# Altium schematic sheet Sheet1.SchDoc
size A4; SheetNumber: 2; SheetTotal: 4
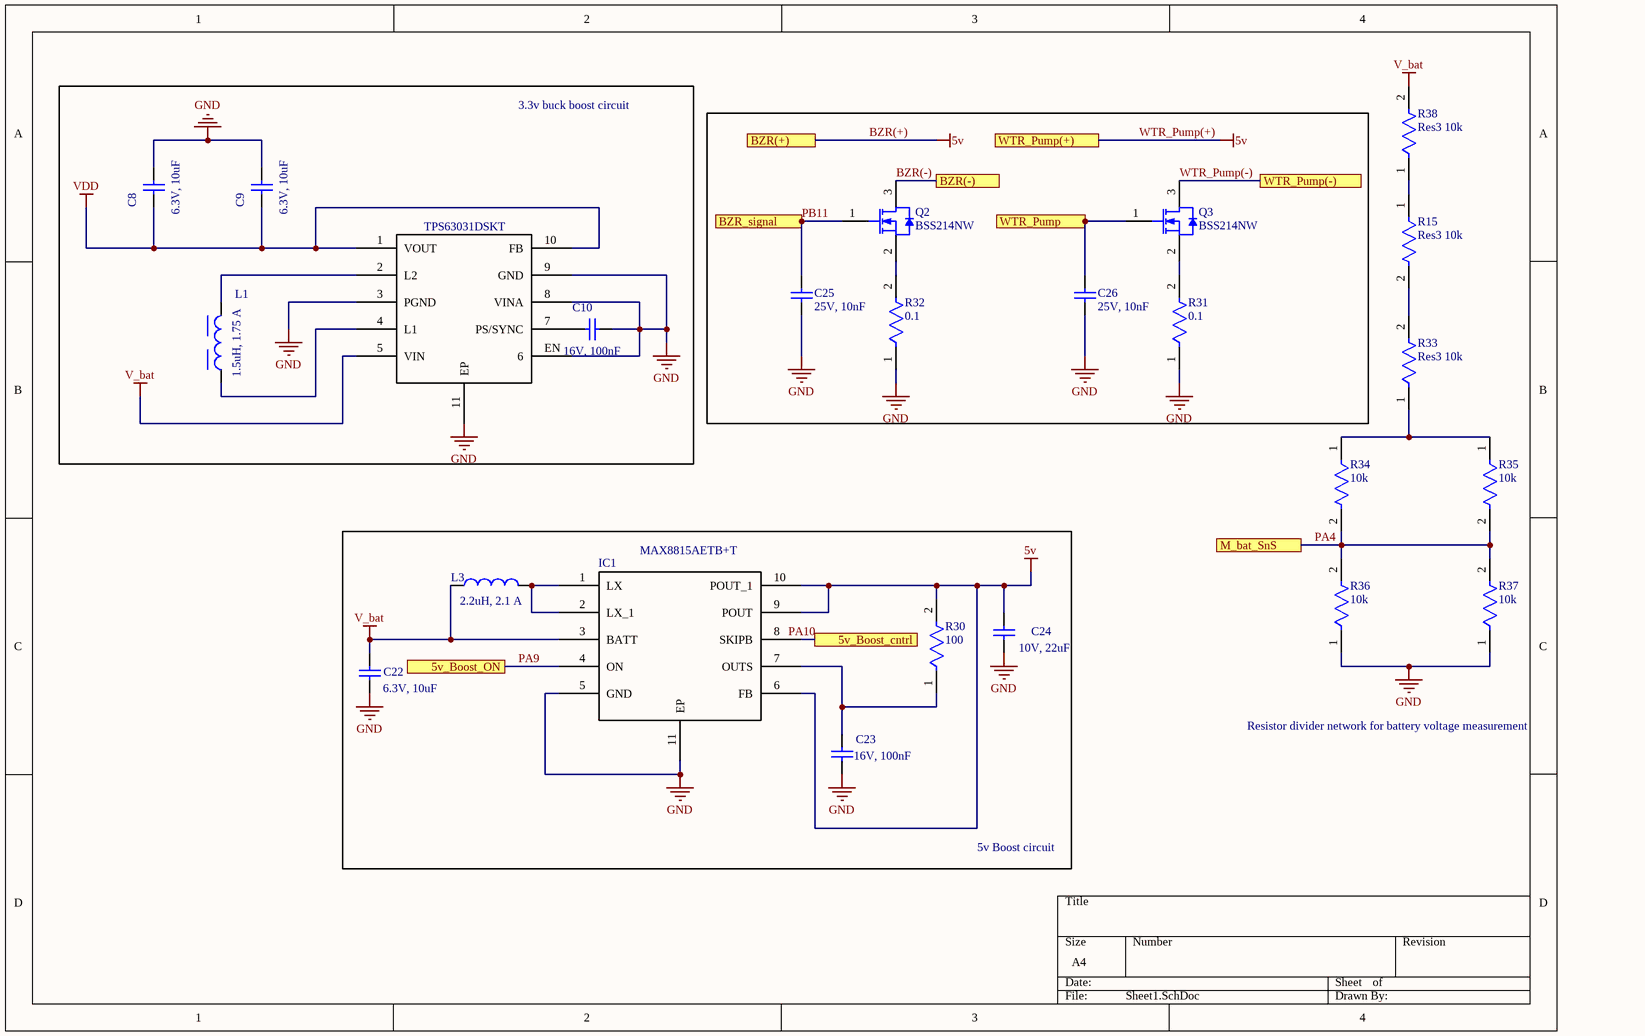
[diagram p0: Sheet1.SchDoc]

## Parts
C8  6.3V, 10uF  [WCAP-CSGP_0603_L1.6W0.8H0.8_Reflow]
C9  6.3V, 10uF  [WCAP-CSGP_0603_L1.6W0.8H0.8_Reflow]
C10  16V, 100nF  [WCAP-CSGP_0603_L1.6W0.8H0.8_Reflow]
C22  6.3V, 10uF  [WCAP-CSGP_0603_L1.6W0.8H0.8_Reflow]
C23  16V, 100nF  [WCAP-CSGP_0603_L1.6W0.8H0.8_Reflow]
C24  10V, 22uF  [WCAP-CSGP_0805_L2W1.25H1.25]
C25  25V, 10nF  [CAPC2013X94X50LL20T25]
C26  25V, 10nF  [CAPC2013X94X50LL20T25]
IC1  MAX8815AETB+T
L1  1.5uH, 1.75 A  [WE-TPC_3816]
L3  2.2uH, 2.1 A  [WE-PMCI_322512]
Q2  BSS214NW  [INF-PG-SOT-323_N]
Q3  BSS214NW  [INF-PG-SOT-323_N]
R15  Res3 10k  [FP-MCT0603-MFG]
R30  100  [FP-RT0603-MFG]
R31  0.1  [FP-RL0603-0_55-MFG]
R32  0.1  [FP-RL0603-0_55-MFG]
R33  Res3 10k  [FP-MCT0603-IPC_B]
R34  10k  [FP-MCT0603-MFG]
R35  10k  [FP-MCT0603-MFG]
R36  10k  [FP-MCT0603-MFG]
R37  10k  [FP-MCT0603-MFG]
R38  Res3 10k  [FP-MCT0603-MFG]
U3  TPS63031DSKT  [R_0603]

## Blocks framed on the sheet
3.3v buck boost circuit: C8-C10 L1 U3
5v Boost circuit: C22-C24 IC1 L3 R30

## Ports
5v_Boost_cntrl (see Sheet3[3C]), 5v_Boost_ON (see Sheet3[3C]), BZR(+) (see Sheet2[3C]), BZR(-) (see Sheet2[3C]), BZR_signal (see Sheet3[3D]), M_bat_SnS (see Sheet3[2D]), WTR_Pump (see Sheet3[3B]), WTR_Pump(+) (see Sheet2[3C]), WTR_Pump(-) (see Sheet2[3C])

## Nets
BZR(+): C24.2 IC1.6(FB) IC1.9(POUT) IC1.10(POUT_1) R30.2 ; port BZR(+), port WTR_Pump(+)  [also labelled 5v, WTR_Pump(+)]
GND: C8.2 C9.2 C10.2 C22.1 C23.1 C24.1 C25.1 C26.1 IC1.5(GND) IC1.11(EP) R31.1 R32.1 R36.1 R37.1 U3.3(PGND) U3.8(VINA) U3.9(GND) U3.11(EP) U3.EN(6)
V_bat: C22.2 IC1.3(BATT) L3.1 R38.2 U3.5(VIN)
VDD: C8.1 C9.1 U3.1(VOUT) U3.10(FB)
5v_Boost_cntrl: IC1.8(SKIPB) ; port 5v_Boost_cntrl
BZR(-): Q2.3(DRAIN) ; port BZR(-)
PA4: R34.2 R35.2 R36.2 R37.2 ; port M_bat_SnS
PA9: IC1.4(ON) ; port 5v_Boost_ON
PB11: C25.2 Q2.1(GATE) ; port BZR_signal
WTR_Pump: C26.2 Q3.1(GATE) ; port WTR_Pump
WTR_Pump(-): Q3.3(DRAIN) ; port WTR_Pump(-)
NetC10_1: C10.1 U3.7(PS/SYNC)
NetC23_2: C23.2 IC1.7(OUTS) R30.1
NetIC1_1: IC1.1(LX) IC1.2(LX_1) L3.2
NetL1_1: L1.1 U3.4(L1)
NetL1_2: L1.2 U3.2(L2)
NetQ2_2: Q2.2(SOURCE) R32.2
NetQ3_2: Q3.2(SOURCE) R31.2
NetR15_1: R15.1 R38.1
NetR15_2: R15.2 R33.2
NetR33_1: R33.1 R34.1 R35.1

## Notes on the sheet
- Resistor divider network for battery voltage measurement
- Labels drawn without touching a wire or pin: PA10

## Library data of the parts
C8 C9 C22 = CMP-03913-53914711-2: Ceramic Capacitor, Multilayer, Ceramic, 6.3V, 20% +Tol, 20% -Tol, X5R, 15% TC, 10uF, Surface Mount, 0603; Capacitance: 10µF; Insulation Resistance: 5MΩ; Min Operating Temperature: -55°C; Max Operating Temperature: 85°C; Length: 1.6mm; Mount: Surface Mount; Height: 800µm; Width: 800µm; Case Code (Metric): 1608; RoHS: Compliant; Thickness: 990.6µm; Voltage Rating (DC): 6.3V; Voltage Rating: 6.3V; Case/Package: 0603; REACH SVHC: Unknown; Tolerance: 20%; Case Code (Imperial): 0603; Dielectric: X5R
C10 C23 = CMP-03913-53914755-2: Cap Ceramic 0.1uF 16V X7R 10% Pad SMD 0603 125C T/R; Insulation Resistance: 5GΩ; Case/Package: 0603; Mount: Surface Mount; Voltage Rating (DC): 16V; Thickness: 863.6µm; RoHS: Compliant; Case Code (Metric): 1608; Tolerance: 10%; Capacitance: 100nF; Length: 1.6mm; Case Code (Imperial): 0603; Height: 800µm; Min Operating Temperature: -55°C; Voltage Rating: 16V; Width: 800µm; Max Operating Temperature: 125°C; REACH SVHC: Unknown; Dielectric: X7R
C24 = CMP-03913-65419736-2: Multilayer Ceramic Capacitor 22uF 0805 2; Capacitance: 22µF; Insulation Resistance: 5MΩ; Tolerance: 20%; Dielectric: X5R; Width: 1.25mm; Voltage Rating (DC): 10V; Height: 1.25mm; REACH SVHC: Unknown; Voltage Rating: 10V; Max Operating Temperature: 85°C; Min Operating Temperature: -55°C; Length: 2mm; Thickness: 1.4478mm; Mount: Surface Mount; Case Code (Metric): 2012; Case Code (Imperial): 0805; Case/Package: 0805; RoHS: Compliant
C25 C26 = CMP-2007-04234-1: Manufacturer: AVX Interconnect / Elco; Part Number: 08053C103JAT2A
L1 = CMP-0227-00364-5: 100KHz 125MHz 1.55A 1.75A 1.5μH 47mΩ ±30% standard mounting，SMD mount 3.8mm*3.8mm*1.8mm; Manufacturer Lifecycle Status: ACTIVE; Core Material: Ferrite; DC Resistance (DCR): 40mΩ; Shielding: Shielded; Current Rating: 1.75A; Max Operating Temperature: 125°C; Self Resonant Frequency: 125MHz; Lifecycle Status: Production; Min Operating Temperature: -40°C; RMS Current (Irms): 1.75A; Weight: 102.993818mg; Height: 1.65mm; Length: 3.8mm; Height - Seated (Max): 1.8034mm; Ambient Temperature Range High: 85°C; Case/Package: Nonstandard; Inductance: 1.5µH; Resistance: 40mΩ; Series Resistance: 47mΩ; Saturation Current: 1.55A; RoHS: Compliant; REACH SVHC: Unknown; Termination: SMD/SMT; Max DC Current: 1.75A; Width: 3.8mm; Composition: Wirewound; Mount: Surface Mount; Inductance Tolerance: 30%; Tolerance: 30%; Test Frequency: 100kHz; Ambient Temperature Range Low: -40°C; Number of Pins: 2
L3 = CMP-03913-71101468-2: We-pmci Series 2.2 Uh Multilayer SMD Inductor, 1210 Case, 25MHZ 2.1A 106MO; Test Frequency: 1MHz; Saturation Current: 2.25A; DC Resistance (DCR): 70mΩ; Inductance: 2.2µH; Shielding: Shielded; Current Rating: 1.5A; Tolerance: 20%; REACH SVHC: Unknown; Case/Package: 1210; Mount: Surface Mount; Max Operating Temperature: 125°C; Case Code (Imperial): 1210; RoHS: Compliant; Min Operating Temperature: -40°C; Case Code (Metric): 3225; Ambient Temperature Range Low: -40°C; Number of Pins: 2; Height - Seated (Max): 1.1938mm; Width: 2.5mm; Length: 3.2mm; Height: 1.2mm; Ambient Temperature Range High: 85°C; Self Resonant Frequency: 25MHz; Inductance Tolerance: 20%
Q2 Q3 = CMP-1149-00041-1: N-Channel OptiMOS 2 Small-Signal-Transistor, 20 V VDS, 1.5 A ID, -55 to 150 degC, PG-SOT-323, Reel, Green; Manufacturer: Infineon; VDS (max): 20 V; VGS(th) (max): 1.2Â V; RthJA (max): 250 K/W; QG: 0.8Â nC; RDS (on) (max) (@4.5V): 140 mOhm; VGS(th) (min): 0.7Â V; IDpuls (max): 6 A; ID (max): 1.5Â A; Ptot (max): 0.5Â W; RDS (on) (max): 250 mOhm; Green: TRUE; PackageDescription: 3-Pin Small Outline Transistor Package, 2 x 1.25 mm Body, 0.65 mm Pitch; ComponentLink3URL: http://www.infineon.com/dgdl/SOT323-Package_Overview.pdf?folderId=db3a30431936bc4b0119533e1dcb3c92&fileId=db3a30431936bc4b011953495f283cb1; DatasheetVersion: Rev. 2.2; Mounting Technology: Surface Mount; ComponentLink2URL: http://www.infineon.com/dgdl/BSS214NW_Rev2.2.pdf?folderId=db3a3043156fd573011622e10b5c1f67&fileId=db3a30431b3e89eb011b695aebc01bde; PackageVersion: Apr-08; Halogen-free: TRUE; Packing: Reel; ComponentLink3Description: Package Specification; PartNumber: BSS214NW; ComponentLink2Description: Datasheet; PackageReference: PG-SOT-323; ComponentLink1URL: http://www.infineon.com/; RDS (on) (max) (@2.5V): 250 mOhm; ComponentLink1Description: Manufacturer URL
R15 R33-R38 = CMP-02407-001090-1: RES SMD 100 OHM 1% 1/8W 0603
R30 = CMP-2000-04516-2: RES SMD 100 OHM 0.1% 1/10W 0603; Manufacturer: Yageo; Manufacturer Part Number: RT0603BRE07100RL; Value: 100Ω; Temperature Coefficient: 50 ppm/°C; Power Rating: 0.1W; Voltage Rating: 75V; Tolerance: 0.001; Lead Free: Yes; Ipc Land Pattern Name: RESC16080X45; Resistance: 100Ω; Package: RT0603; Device Class L1: Passive Components; Temperature Range High: +155°C; Height: 0.55mm; Automotive: No; Octopart: https://octopart.com/rt0603bre07100rl-yageo-1483384; Composition: Thin Film; Device Class L2: Resistors; Device Class L3: Chip SMD Resistors; Series: RT; Digikey Description: RES SMD 100 OHM 0.1% 1/10W 0603; RoHS: TRUE; ComponentLink2URL: http://www.yageo.com/documents/recent/PYu-RT_1-to-0.01_RoHS_L_9.pdf; Temperature Range Low: -55°C; Category: Res; Footprint Url: http://www.yageo.com/exep/pages/download/literatures/PYu-R_Mount_10.pdf; ComponentLink2Description: Datasheet; Temperature: -55°C to +155°C
R31 R32 = CMP-03412-037808-1: RES 0.1 OHM 1% 1/10W 0603; Voltage Rating: 50V; Temperature Coefficient: 800ppm/°C; Max Power Dissipation: 100mW; Resistance: 100mR; Case Code (Metric): 1608; Min Operating Temperature: -55°C; Radiation Hardening: No; Case/Package: 0603; Termination: SMD/SMT; Length: 1.6mm; Lead Free: Lead Free; Size Code: 0603; Construction: Rectangular; RoHS Compliant: Yes; Package Quantity: 1; Tolerance: 1%; Military Standard: Not; Height: 0.022inch; Contact Plating: Tin; Resistance Tolerance: 1%; Resistor Type: Thick Film; Technology: THICK FILM; Lead Pitch: 0.25mm; Series: RL; Number of Pins: 2; Width: 0.8mm; Packaging: Tape and Reel; Weight: 7.1E-05oz; Max Operating Temperature: 125°C; Features: Moisture Resistant; Number of Terminations: 2; Voltage Rating (DC): 50V; Case Code (Imperial): 0603; Depth: 0.8mm; Power Rating: 100mW
U3 = TPS63031DSKT: High Efficient Single Inductor Buck-Boost Converter with 1-A Switches 10-SON -40 to 125